# EAGLE schematic game piece (EAGLE 8.5.1)
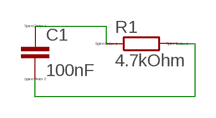
[diagram p0: schematic, sheet 1]

## Parts
C1  100nF  CC0603  [C0603]
R1  4.7kOhm  RR0603  [R0603]

## Nets
N$1: C1.1 R1.1
N$2: C1.2 R1.2

## Library data of the parts
C1 = eagle-ltspice:C: CAPACITOR, European symbol; SPICEMODEL: NONE; SPICEPREFIX: C
R1 = eagle-ltspice:R: RESISTOR, European symbol; SPICEMODEL: NONE; SPICEPREFIX: R